# Altium project Quail_3.0.PrjPcb (part 2 of 3)

## Sheet LevelShifter.SchDoc: Misc
size Legal; Project: Olympus; Organization: Stanford SSI; Address1: L3, 12a Rodborough Rd; Address2: Frenchs Forest; Address3: NSW; Address4: Australia 2086; SheetNumber: n; SheetTotal: m
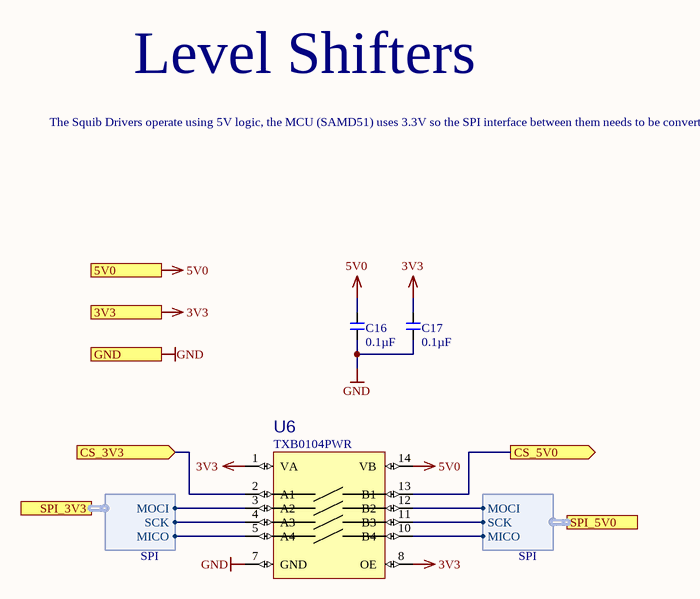
[diagram p3: LevelShifter.SchDoc]

### Parts
C16  Capacitance (shorthand): 0.1µF  [C0603]  (hidden comment: 490-1519-1-ND)
C17  Capacitance (shorthand): 0.1µF  [C0603]  (hidden comment: 490-1519-1-ND)
U6  Manufacturer Part Number: TXB0104PWR  [14TSSOP65]  (hidden comment: LVLSHFT_TXB0104PWR)

### Ports
3V3 (in), 5V0 (in), CS_3V3 (in), CS_5V0 (out), GND (in), SPI_3V3 (harness SPI), SPI_5V0 (harness SPI)

### Harnesses
SPI: MICO, MOCI, SCK

### Nets
3V3: C17.1 U6.1(VA) U6.8(OE) ; port 3V3  [project net IOVDD]
5V0: C16.1 U6.14(VB) ; port 5V0
GND: C16.2 C17.2 U6.7(GND) ; port GND  [project net DGND]
SQB_CS: U6.2(A1) ; port CS_3V3
SQB_MICO: U6.5(A4) ; port SPI_3V3.MICO
SQB_MOCI: U6.3(A2) ; port SPI_3V3.MOCI
SQB_SCK: U6.4(A3) ; port SPI_3V3.SCK
SQUIB_CS: U6.13(B1) ; port CS_5V0
Squib_MICO: U6.10(B4) ; port SPI_5V0.MICO
Squib_MOCI: U6.12(B2) ; port SPI_5V0.MOCI
Squib_SCK: U6.11(B3) ; port SPI_5V0.SCK

### Notes on the sheet
- Level Shifters
- The Squib Drivers operate using 5V logic, the MCU (SAMD51) uses 3.3V so the SPI interface between them needs to be converted
- PROJECT
- SHEET
- Powered By
- Sheet
- of
- REVISION
- ssi.stanford.edu
- ENGINEER
- REVIEWER
- REVIEWED ON

### Library data of the parts
C16 C17 = CMP-119-0065-1: as C7 on sheet BatteryRegulators; Rated Voltage: 50V; Dielectric: X7R
U6 = CMP-045-0016-1: 4 Pin Bidirectional levelshifter 5v-3.3v; Manufacturer: Texas Instruments; Translator Type: Voltage Level; Number of Circuits: 1; Channels per Circuit: 4; Voltage - VCCA: 1.2 V ~ 3.6 V; Voltage - VCCB: 1.65 V ~ 5.5 V; Output Type: Tri-State, Non-Inverted; Data Rate: 100Mbps; Value: *; RoHS: RoHS Compliant; Stock 1: 16134; Pricing 1: 1=1.39, 10=1.246, 100=0.9717, 500=0.8036, 1000=0.6355 (USD); Packaging: Cut Tape (CT); Channel Type: Bidirectional; Input Signal: -; Output Signal: -; Operating Temperature: -40°C ~ 85°C (TA); Features: Auto-Direction Sensing; Mounting Type: Surface Mount; Package / Case: 14-TSSOP (0.173", 4.40mm Width); Supplier Device Package: 14-TSSOP; ComponentLink1URL: http://www.ti.com/lit/ds/symlink/txb0104.pdf; ComponentLink1Description: http://www.ti.com/lit/ds/symlink/txb0104.pdf; Source: ic_interface.SchLib; Design Item ID: LVLSHFT_TXB0104PWR

## Sheet Blink_Blink_Beep_Boop.SchDoc: Blinks and Boops
size Legal; DocumentNumber: 8; SheetNumber: 8; SheetTotal: 8; Project: Olympus
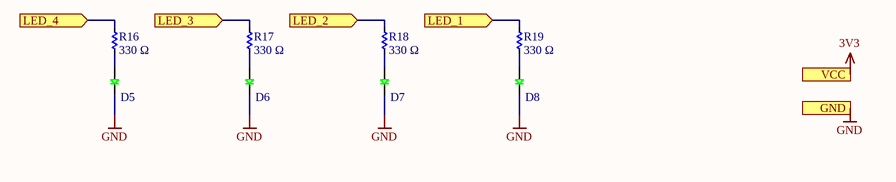
[diagram p4: Blink_Blink_Beep_Boop.SchDoc]

### Parts
D5  LED_C503B-GCS-CB0C0781  [LED_TH_5MM]  (value not drawn)
D6  LED_C503B-GCS-CB0C0781  [LED_TH_5MM]  (value not drawn)
D7  LED_C503B-GCS-CB0C0781  [LED_TH_5MM]  (value not drawn)
D8  LED_C503B-GCS-CB0C0781  [LED_TH_5MM]  (value not drawn)
R16  Resistance: 330 Ω  [R0603]  (hidden comment: 311-330HRCT-ND)
R17  Resistance: 330 Ω  [R0603]  (hidden comment: 311-330HRCT-ND)
R18  Resistance: 330 Ω  [R0603]  (hidden comment: 311-330HRCT-ND)
R19  Resistance: 330 Ω  [R0603]  (hidden comment: 311-330HRCT-ND)

### Ports
GND (in), LED_1 (in), LED_2 (in), LED_3 (in), LED_4 (in), VCC (in)

### Nets
GND: D5.2(K) D6.2(K) D7.2(K) D8.2(K) ; port GND  [project net DGND]
LED1: R19.2 ; port LED_1
LED2: R18.2 ; port LED_2
LED3: R17.2 ; port LED_3
LED4: R16.2 ; port LED_4
NetD5_1: D5.1(A) R16.1
NetD6_1: D6.1(A) R17.1
NetD7_1: D7.1(A) R18.1
NetD8_1: D8.1(A) R19.1

### Notes on the sheet
- PROJECT
- SHEET
- Powered By
- Sheet
- of
- REVISION
- ssi.stanford.edu
- ENGINEER
- REVIEWER
- REVIEWED ON

### Library data of the parts
D5-D8 = CMP-033-0070-3: LED GREEN CLEAR 5MM ROUND T/H; Manufacturer: Cree; Lens Colour: Colorless; Luminous Intensity: 24850mcd; Viewing Angle: 30°; Forward Current: 20mA; Forward Voltage: 3.2V; Lens Style: Dome; Dominant Wavelength: 527nm; Power Rating: 120mW; Reverse Voltage (DC): 5V; Number of LEDs: 1; Manufacturer Part Number: C503B-GCS-CB0C0781; Stock 1: 191; Pricing 1: 1=0.25, 10=0.236, 100=0.2184, 1000=0.1954, 50000=0.1814 (USD); Mount: Through Hole; Case/Package: Radial; Colour: Green; Min Operating Temperature: -40°C; Max Operating Temperature: 95°C; Illumination Colour: Green; Packaging: Bulk; Package Quantity: 500; Lens Transparency: Clear; Test Current: 20mA; Wavelength: 527nm; Length: 5.8mm; Height: 12.7mm; Width: 5mm; ComponentLink1URL: http://www.mouser.com/ds/2/90/cree.C503B%20BAS%20BAN%20BCS%20BCN%20GAS%20GAN%20GCS%20GCN%201094[1]-310350.pdf; ComponentLink1Description: http://www.mouser.com/ds/2/90/cree.C503B%20BAS%20BAN%20BCS%20BCN%20GAS%20GAN%20GCS%20GCN%201094[1]-310350.pdf; ComponentLink2URL: http://www.cree.com/led-components/media/documents/C503B-BAS-BAN-BCS-BCN-GAS-GAN-GCS-GCN-1094.pdf; ComponentLink2Description: http://www.cree.com/led-components/media/documents/C503B-BAS-BAN-BCS-BCN-GAS-GAN-GCS-GCN-1094.pdf; Design Item ID: LED_C503B-GCS-CB0C0781; Source: diode.SchLib
R16-R19 = CMP-126-0120-2: RES SMD 330 OHM 1% 1/10W 0603; Manufacturer Part Number: RC0603FR-07330RL; Manufacturer: Yageo; Resistance (Sortable): 330; Power (Watts): 0.1W, 1/10W; Temperature Coefficient: ±100ppm/°C; Datasheets: http://www.yageo.com/documents/recent/PYu-RC_Group_51_RoHS_L_9.pdf; Image: //media.digikey.com/Renders/Yageo%20Renders/0603-(1608-Metric).jpg; Tolerance: ±1%; Operating Temperature: -55°C ~ 155°C

## Sheet SAMD51.SchDoc
size A3
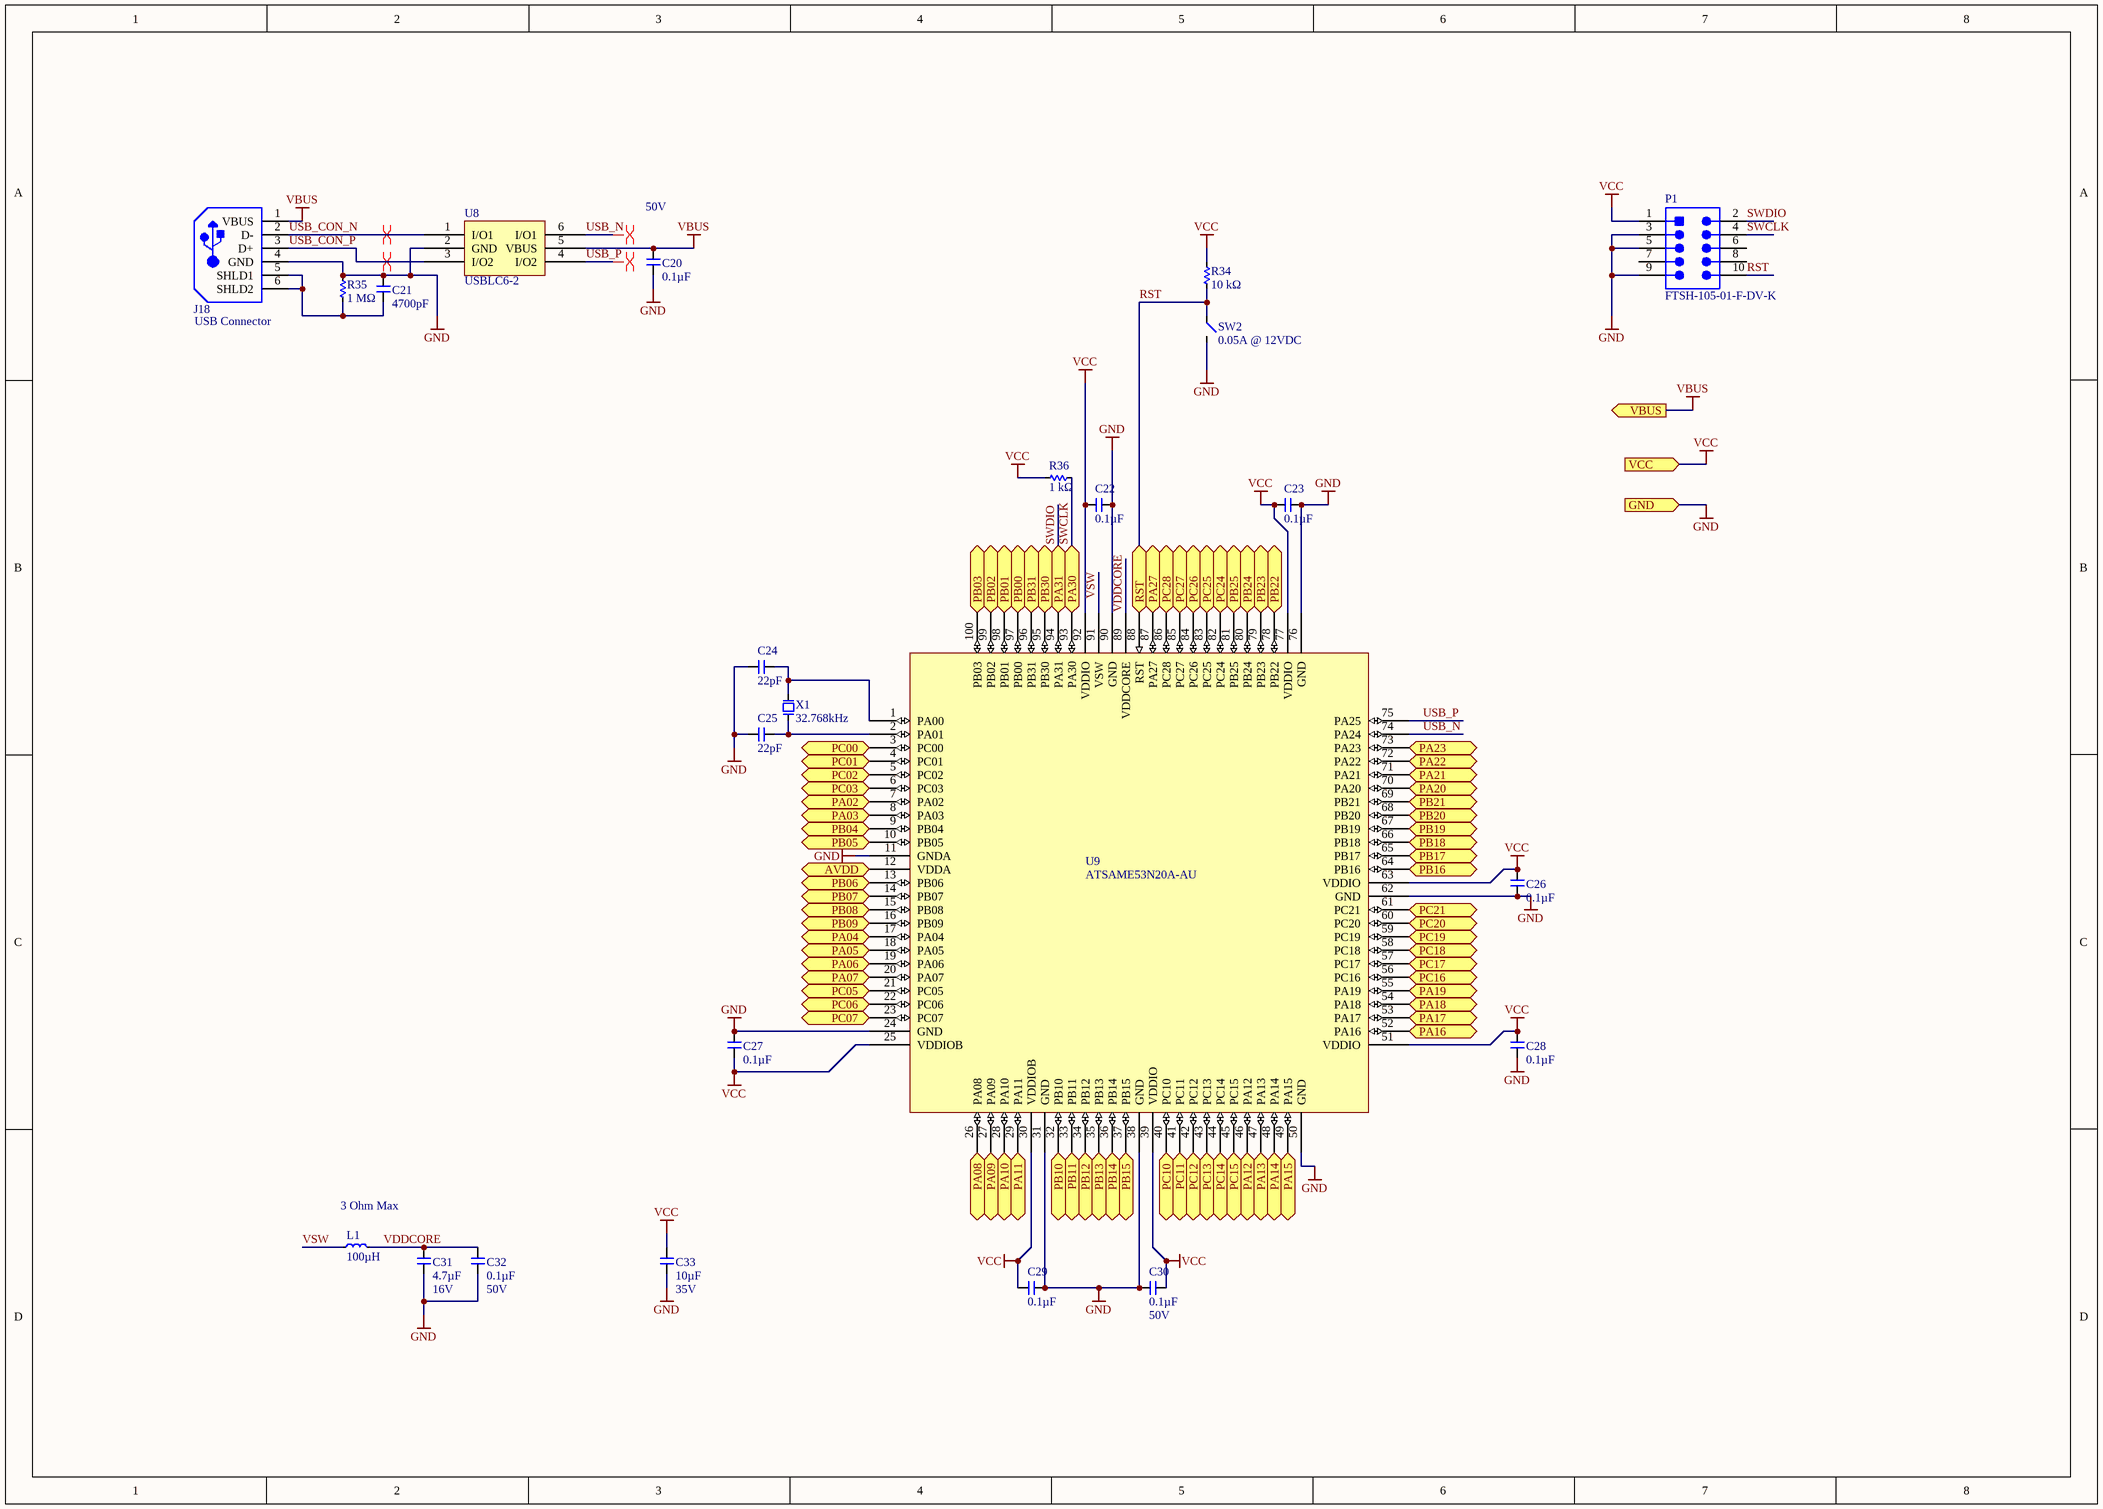
[diagram p5: SAMD51.SchDoc]

### Parts
C20  Capacitance (shorthand): 0.1µF  Rated Voltage: 50V  [C0603]  (hidden comment: 490-1519-1-ND)
C21  Capacitance (shorthand): 4700pF  [C0603]  (hidden comment: 490-1506-1-ND)
C22  Capacitance (shorthand): 0.1µF  [C0603]  (hidden comment: 490-1519-1-ND)
C23  Capacitance (shorthand): 0.1µF  [C0603]  (hidden comment: 490-1519-1-ND)
C24  Capacitance (shorthand): 22pF  [C0603]  (hidden comment: 490-1411-1-ND)
C25  Capacitance (shorthand): 22pF  [C0603]  (hidden comment: 490-1411-1-ND)
C26  Capacitance (shorthand): 0.1µF  [C0603]  (hidden comment: 490-1519-1-ND)
C27  Capacitance (shorthand): 0.1µF  [C0603]  (hidden comment: 490-1519-1-ND)
C28  Capacitance (shorthand): 0.1µF  [C0603]  (hidden comment: 490-1519-1-ND)
C29  Capacitance (shorthand): 0.1µF  [C0603]  (hidden comment: 490-1519-1-ND)
C30  Capacitance (shorthand): 0.1µF  Rated Voltage: 50V  [C0603]  (hidden comment: 490-1519-1-ND)
C31  Capacitance (shorthand): 4.7µF  Rated Voltage: 16V  [C0603]  (hidden comment: 311-1785-1-ND)
C32  Capacitance (shorthand): 0.1µF  Rated Voltage: 50V  [C0603]  (hidden comment: 490-1519-1-ND)
C33  Capacitance (shorthand): 10µF  Rated Voltage: 35V  [C0603]  (hidden comment: 490-13248-1-ND)
J18  USBR-B-S-S-O-TH  [SMTC-USBR-TH-4_V]  (value not drawn)
L1  DC Resistance (DCR): 3 Ohm Max  Inductance: 100µH  [C1210]  (hidden comment: IND_BRL3225T101K)
P1  FTSH-105-01-F-DV-K  [SMTC-FTSH-105-01-L-DV-K_V]
R34  Resistance: 10 kΩ  [R0603]  (hidden comment: 311-10.0KHRCT-ND)
R35  Resistance: 1 MΩ  [R0603]  (hidden comment: 311-1.00MHRCT-ND)
R36  Resistance: 1 kΩ  [R0603]  (hidden comment: 311-1.00KHRCT-ND)
SW2  Contact Rating @ Voltage: 0.05A @ 12VDC  [SWITCH_FSM4JSMATR]  (hidden comment: SWITCH_FSM4JSMATR)
U8  USBLC6-2  [6SOT23]
U9  ATSAME53N20A-AU  [TSQFP50P1600X1600X120-100N]
X1  Frequency: 32.768kHz  [XTAL_TXC_9HT10]  (hidden comment: XTAL_9HT10-32.768KEZF-T)

### Ports
AVDD (bidir), GND (in), PA02 (bidir), PA03 (bidir), PA04 (bidir), PA05 (bidir), PA06 (bidir), PA07 (bidir), PA08 (bidir), PA09 (bidir), PA10 (bidir), PA11 (bidir), PA12 (bidir), PA13 (bidir), PA14 (bidir), PA15 (bidir), PA16 (bidir), PA17 (bidir), PA18 (bidir), PA19 (bidir), PA20 (bidir), PA21 (bidir), PA22 (bidir), PA23 (bidir), PA27 (bidir), PA30 (bidir), PA31 (bidir), PB00 (bidir), PB01 (bidir), PB02 (bidir), PB03 (bidir), PB04 (bidir), PB05 (bidir), PB06 (bidir), PB07 (bidir), PB08 (bidir), PB09 (bidir), PB10 (bidir), PB11 (bidir), PB12 (bidir), PB13 (bidir), PB14 (bidir), PB15 (bidir), PB16 (bidir), PB17 (bidir), PB18 (bidir), PB19 (bidir), PB20 (bidir), PB21 (bidir), PB22 (bidir), PB23 (bidir), PB24 (bidir), PB25 (bidir), PB30 (bidir), PB31 (bidir), PC00 (bidir), PC01 (bidir), PC02 (bidir), PC03 (bidir), PC05 (bidir), PC06 (bidir), PC07 (bidir), PC10 (bidir), PC11 (bidir), PC12 (bidir), PC13 (bidir), PC14 (bidir), PC15 (bidir), PC16 (bidir), PC17 (bidir), PC18 (bidir), PC19 (bidir), PC20 (bidir), PC21 (bidir), PC24 (bidir), PC25 (bidir), PC26 (bidir), PC27 (bidir), PC28 (bidir), RST (bidir), VBUS (out), VCC (in)

### Nets
GND: C20.2 C21.1 C22.1 C23.1 C24.1 C25.1 C26.1 C27.1 C28.1 C29.2 C30.2 C31.1 C32.2 C33.1 J18.4(GND) P1.3 P1.5 P1.9 R35.2 SW2.2 U8.2(GND) U9.11(GNDA) U9.24(GND) U9.31(GND) U9.38(GND) U9.50(GND) U9.62(GND) U9.76(GND) U9.90(GND) ; port GND  [project net DGND]
VBUS: C20.1 J18.1(VBUS) U8.5(VBUS) ; port VBUS
VCC: C22.2 C23.2 C26.2 C27.2 C28.2 C29.1 C30.1 C33.2 P1.1 R34.1 R36.2 U9.12(VDDA) U9.25(VDDIOB) U9.30(VDDIOB) U9.39(VDDIO) U9.51(VDDIO) U9.63(VDDIO) U9.77(VDDIO) U9.92(VDDIO) ; port VCC, port AVDD  [project net IOVDD]
ADC_CS: U9.69(PB21) ; port PB21
ADC_MICO: U9.79(PB23) ; port PB23
ADC_MOCI: U9.85(PC27) ; port PC27
ADC_SCK: U9.86(PC28) ; port PC28
ADC_SYNC: U9.87(PA27) ; port PA27
BatterySense: U9.15(PB08) ; port PB08
BUSY: U9.83(PC25) ; port PC25
CAN_STBY_1: U9.68(PB20) ; port PB20
CurrentSense: U9.16(PB09) ; port PB09
DIO1: U9.82(PC24) ; port PC24
ETH_CRS_DV: U9.60(PC20) ; port PC20
ETH_INT: U9.96(PB31) ; port PB31
ETH_MDC: U9.36(PB14) ; port PB14
ETH_MDIO: U9.37(PB15) ; port PB15
ETH_REF_CLK: U9.48(PA14) ; port PA14
ETH_RXD0: U9.47(PA13) ; port PA13
ETH_RXD1: U9.46(PA12) ; port PA12
ETH_RXER: U9.49(PA15) ; port PA15
ETH_TXD0: U9.54(PA18) ; port PA18
ETH_TXD1: U9.55(PA19) ; port PA19
ETH_TXEN: U9.53(PA17) ; port PA17
GPS_PPS: U9.78(PB22) ; port PB22
GPS_RX: U9.80(PB24) ; port PB24
GPS_TX: U9.81(PB25) ; port PB25
LED1: U9.64(PB16) ; port PB16
LED2: U9.65(PB17) ; port PB17
LED3: U9.66(PB18) ; port PB18
LED4: U9.67(PB19) ; port PB19
NRESET: U9.84(PC26) ; port PC26
PWR_FLT: U9.6(PC03) ; port PC03
RST: P1.10 R34.2 SW2.1 U9.88(RST) ; port RST
SD_CLK: U9.33(PB11) ; port PB11
SD_CMD: U9.26(PA08) ; port PA08
SD_DAT0: U9.27(PA09) ; port PA09
SD_DAT1: U9.28(PA10) ; port PA10
SD_DAT2: U9.29(PA11) ; port PA11
SD_DAT3: U9.32(PB10) ; port PB10
SOL_CTRL: U9.13(PB06) ; port PB06
SOL_CTRL: U9.14(PB07) ; port PB07  [a separate net that carries the same name]
SOL_CTRL: U9.17(PA04) ; port PA04  [a separate net that carries the same name]
SOL_CTRL: U9.18(PA05) ; port PA05  [a separate net that carries the same name]
SOL_CTRL: U9.19(PA06) ; port PA06  [a separate net that carries the same name]
SOL_CTRL: U9.20(PA07) ; port PA07  [a separate net that carries the same name]
SOL_CTRL: U9.40(PC10) ; port PC10  [a separate net that carries the same name]
SOL_CTRL: U9.41(PC11) ; port PC11  [a separate net that carries the same name]
SOL_CTRL: U9.42(PC12) ; port PC12  [a separate net that carries the same name]
SOL_CTRL: U9.43(PC13) ; port PC13  [a separate net that carries the same name]
SOL_CTRL: U9.44(PC14) ; port PC14  [a separate net that carries the same name]
SOL_CTRL: U9.45(PC15) ; port PC15  [a separate net that carries the same name]
SQB_CS: U9.58(PC18) ; port PC18
SQB_MICO: U9.59(PC19) ; port PC19
SQB_MOCI: U9.57(PC17) ; port PC17
SQB_SCK: U9.56(PC16) ; port PC16
SWCLK: P1.4 R36.1 U9.93(PA30) ; port PA30
SWDIO: P1.2 U9.94(PA31) ; port PA31
USB_CON_N: J18.2(D-) U8.1(I/O1)
USB_CON_P: J18.3(D+) U8.3(I/O2)
USB_N: U8.6(I/O1) U9.74(PA24)
USB_P: U8.4(I/O2) U9.75(PA25)
VDDCORE: C31.2 C32.1 L1.1 U9.89(VDDCORE)
VSW: L1.2 U9.91(VSW)
NetC21_2: C21.2 J18.5(SHLD1) J18.6(SHLD2) R35.1
NetC24_2: C24.2 U9.1(PA00) X1.2
NetC25_2: C25.2 U9.2(PA01) X1.1
NetCANA1_1: U9.35(PB13) ; port PB13
NetCANA1_4: U9.34(PB12) ; port PB12
NetTP1_1: U9.23(PC07) ; port PC07
NetTP2_1: U9.22(PC06) ; port PC06
NetTP3_1: U9.21(PC05) ; port PC05
NetTP30_1: U9.10(PB05) ; port PB05
NetTP31_1: U9.95(PB30) ; port PB30
NetTP32_1: U9.52(PA16) ; port PA16
NetTP33_1: U9.61(PC21) ; port PC21
NetTP34_1: U9.9(PB04) ; port PB04
NetTP35_1: U9.97(PB00) ; port PB00
NetTP36_1: U9.98(PB01) ; port PB01
NetTP37_1: U9.99(PB02) ; port PB02
NetTP38_1: U9.100(PB03) ; port PB03
NetTP39_1: U9.8(PA03) ; port PA03
NetTP40_1: U9.7(PA02) ; port PA02
NetTP41_1: U9.3(PC00) ; port PC00
NetTP42_1: U9.4(PC01) ; port PC01
NetTP43_1: U9.5(PC02) ; port PC02
NetU9_70: U9.70(PA20) ; port PA20
NetU9_71: U9.71(PA21) ; port PA21
NetU9_72: U9.72(PA22) ; port PA22
NetU9_73: U9.73(PA23) ; port PA23

Not connected (* = marked no-connect by the designer): P1 6 7 8

### Layout directives
differential pair: USB_CON_N, USB_CON_P, USB_N, USB_P

### Notes on the sheet
- (near J18) USB Connector
- Title
- Size:
- Date:
- A4
- Number:
- Time:
- Revision:
- Sheet
- of
- File:

### Library data of the parts
C20 C22 C23 C26-C30 C32 = CMP-119-0065-1: as C7 on sheet BatteryRegulators; Dielectric: X7R
  C22 C23 C26-C29: Rated Voltage: 50V
C21 = CMP-119-0049-1: CAP CER 0603 4700pF X7R 50V 10%; Manufacturer: Murata Electronics North America; Capacitance - pF (Machine readable): #NAME?; Dielectric: X7R; Rated Voltage: 50V
C24 C25 = CMP-119-0008-1: CAP CER 22PF 50V C0G/NP0 0603; Manufacturer: Murata Electronics North America; Capacitance - pF (Machine readable): 22; Dielectric: C0G, NP0; Rated Voltage: 50V
C31 = CMP-119-0070-1: CAP CER 4.7UF 16V X5R 0603 10%; Manufacturer: Yageo; Capacitance - pF (Machine readable): #NAME?; Dielectric: X5R
C33 = CMP-119-0071-1: as C8 on sheet BatteryRegulators; Dielectric: X5R
J18 = CMP-00011-3: Conn USB F 4 POS 2.5mm Solder RA Thru-Hole 4 Terminal 1 Port Tray; Max Voltage Rating (AC): 30V; USB Standard: USB 2.0; Number of Contacts: 4; Gender: Receptacle; Number of Ports: 1; Contact Plating: Gold; REACH SVHC: No SVHC; Radiation Hardening: No; Mount: Through Hole,Horizontal; Packaging: Tray; Length: 14.9mm; Max Operating Temperature: 85°C; Termination: Solder; Depth: 16.5mm; Connector Type: USB; Contact Material: Bronze; Pitch: 2.5mm; Series: -; Number of Terminals/Pins: 4; Orientation: Right Angle; Package Quantity: 1; Min Operating Temperature: -50°C; Housing Material: Thermoplastic
L1 = CMP-052-0010-1: INDUCTOR 100UH 270MA 1210 SMD; Manufacturer: Taiyo Yuden; Current - Temperature Rise: 250mA; Tolerance: ±10%; Shielding: Unshielded; Frequency - Self Resonant: 5MHz; Frequency - Test: 100kHz; Manufacturer Part Number: BRL3225T101K; RoHS: RoHS Compliant; Current - Saturation: 270mA; Q @ Freq: -; Applications: Power Supplies; Material - Core: -; Package / Case: 1210 (3225 Metric); Mounting Type: Surface Mount; Packaging: Cut Tape (CT); Operating Temperature: -40°C ~ 105°C; ComponentLink1URL: http://www.yuden.co.jp/ut/product/pdf/wound07_e.pdf; ComponentLink1Description: Datasheet; Current: 270mA; Stock 1: 84687; Source: inductor.SchLib; Pricing 1: 1=0.16, 10=0.155, 50=0.145, 100=0.1354, 500=0.10638, 1000=0.08704 (GBP); Design Item ID: IND_BRL3225T101K
P1 = CMP-2000-05352-1: Male Header, Pitch 1.27 mm, 2 x 5 Position, Height 6.12 mm, RoHS, Tube; Manufacturer: Samtec; Number of Positions: 10; Connector Type: Header,Shrouded; Number of Positions Loaded: All; Row Spacing: 0.050"(1.27mm); Fastening Type: -; Package Reference: FTSH-105-01-L-DV-K; Termination: Solder; Package URL: http://suddendocs.samtec.com/prints/ftsh-1xx-xx-xxx-dv-xxx-footprint.pdf; Number of Rows: 2; Contact Finish Thickness: 3µin(0.08µm); Contact Type: MalePin; Manufacturer URL: http://www.samtec.com/; Series: FTSH; Features: -; Contact Finish: Gold; Color: Black; Family: RectangularConnectors-Headers,MalePins; Datasheet URL: http://suddendocs.samtec.com/prints/ftsh-1xx-xx-xxx-dv-xxx-mkt.pdf; Package Description: Male Header, Pitch 1.27 mm, 2 x 5 Position, Height 5.97 mm, Tail Length 4.32 mm; Mounting Type: SurfaceMount; Datasheet Version: Rev. ET, 10/1995; Category: Connectors,Interconnects; Packaging: Tube; Contact Mating Length: 0.120"(3.05mm); Pitch: 0.050"(1.27mm)
R34 = CMP-126-0273-2: RES SMD 10K OHM 1% 1/10W 0603; Manufacturer Part Number: RC0603FR-0710KL; Manufacturer: Yageo; Resistance (Sortable): 10000; Power (Watts): 0.1W, 1/10W; Temperature Coefficient: ±100ppm/°C; Datasheets: http://www.yageo.com/documents/recent/PYu-RC_Group_51_RoHS_L_9.pdf; Image: //media.digikey.com/Renders/Yageo%20Renders/0603-(1608-Metric).jpg; Tolerance: ±1%; Operating Temperature: -55°C ~ 155°C
R35 = CMP-126-0484-2: RES SMD 1M OHM 1% 1/10W 0603; Manufacturer Part Number: RC0603FR-071ML; Manufacturer: Yageo; Resistance (Sortable): 1000000; Power (Watts): 0.1W, 1/10W; Temperature Coefficient: ±100ppm/°C; Datasheets: http://www.yageo.com/documents/recent/PYu-RC_Group_51_RoHS_L_9.pdf; Image: //media.digikey.com/Renders/Yageo%20Renders/0603-(1608-Metric).jpg; Tolerance: ±1%; Operating Temperature: -55°C ~ 155°C
R36 = CMP-126-0172-2: RES SMD 1K OHM 1% 1/10W 0603; Manufacturer Part Number: RC0603FR-071KL; Manufacturer: Yageo; Resistance (Sortable): 1000; Power (Watts): 0.1W, 1/10W; Temperature Coefficient: ±100ppm/°C; Datasheets: http://www.yageo.com/documents/recent/PYu-RC_Group_51_RoHS_L_9.pdf; Image: //media.digikey.com/Renders/Yageo%20Renders/0603-(1608-Metric).jpg; Tolerance: ±1%; Operating Temperature: -55°C ~ 155°C
SW2 = CMP-062-0009-1: SWITCH TACTILE SPST-NO 0.05A 12V; Manufacturer: TE Connectivity; Switch Function: Off-Mom; Actuator Type: Standard; Actuator Height off PCB, from Pins: 5.00mm; Actuator Orientation: Top Actuated; Outline: 6.00mm x 6.00mm; Illumination: Non-Illuminated; Operating Force: 160gf; Actuator Material: Polyphenylene Sulfide (PPS); Switch Travel: 0.25mm; Mechanical Life: 100,000 Cycles; Manufacturer Part Number: FSM4JSMATR; RoHS: RoHS Compliant; Stock 1: 24144; Pricing 1: 1=0.36, 10=0.34, 25=0.2912, 50=0.2474, 100=0.2377, 250=0.21344, 500=0.20374 (USD); Circuit: SPST-NO; Mounting Type: Surface Mount; Termination Style: Gull Wing; Illumination Voltage (Nominal): -; Illumination Type, Color: -; Ingress Protection: -; Features: -; Packaging: Cut Tape (CT); Operating Temperature: -35°C ~ 85°C; ComponentLink1URL: http://www.te.com/commerce/DocumentDelivery/DDEController?Action=srchrtrv&DocNm=2-1437565-7&DocType=Customer+Drawing&DocLang=English; ComponentLink1Description: Datasheet; Source: miscellaneous.SchLib; Design Item ID: SWITCH_FSM4JSMATR
U8 = CMP-038-0001-1: Manufacturer: STMicroelectronics; Manufacturer Part Number: USBLC6-2SC6; Unidirectional Channels: 2; Voltage - Reverse Standoff (Typ): 5.25V; Voltage - Breakdown (Min): 6V; Voltage - Clamping (Max) @ Ipp: 17V; Current - Peak Pulse (10/1000µs): 5A (8/20µs); Power Line Protection: Yes; RoHS: RoHS Compliant; Stock 1: 31719; Pricing 1: 1=0.51, 10=0.411, 100=0.2802, 500=0.21012, 1000=0.15759 (USD); Packaging: Cut Tape (CT); Part Status: Active; Bidirectional Channels: -; Power - Peak Pulse: -; Applications: Ethernet; Capacitance @ Frequency: -; Operating Temperature: -40°C ~ 125°C (TJ); Mounting Type: Surface Mount; Package / Case: SOT-23-6; Supplier Device Package: SOT-23-6; ComponentLink1URL: http://www.st.com/web/en/resource/technical/document/datasheet/CD00050750.pdf; ComponentLink1Description: http://www.st.com/web/en/resource/technical/document/datasheet/CD00050750.pdf; Design Item ID: USBLC6-2; Source: ic_analog.SchLib
U9 = CMP-025-0003-5: MCU 32-bit ARM Cortex M4F RISC 1MB Flash 3.3V 100-Pin TQFP Tray
X1 = CMP-066-0008-1: CRYSTAL 32.768 KHZ 12.5 PF SMD; Manufacturer: TXC CORPORATION; Frequency Tolerance: ±10ppm; ESR (Equivalent Series Resistance): 70 kOhm; Operating Mode: Fundamental; Load Capacitance: 12.5pF; Manufacturer Part Number: 9HT10-32.768KEZF-T; RoHS: RoHS Compliant; Stock 1: 5250; Pricing 1: 1=1.88, 10=1.625, 50=1.425, 100=1.125, 500=0.95, 1000=0.75 (USD); Frequency Stability: -; Operating Temperature: -40°C ~ 85°C; Ratings: -; Mounting Type: Surface Mount; Package / Case: 2-SMD; Size / Dimension: 0.126" L x 0.059" W (3.20mm x 1.50mm); Height: 0.033" (0.85mm); Packaging: Cut Tape (CT); ComponentLink1URL: http://www.txccrystal.com/images/pdf/9ht10.pdf; ComponentLink1Description: Datasheet; Design Item ID: XTAL_9HT10-32.768KEZF-T; Source: oscillator.SchLib

## Sheet SD.SchDoc
size A4
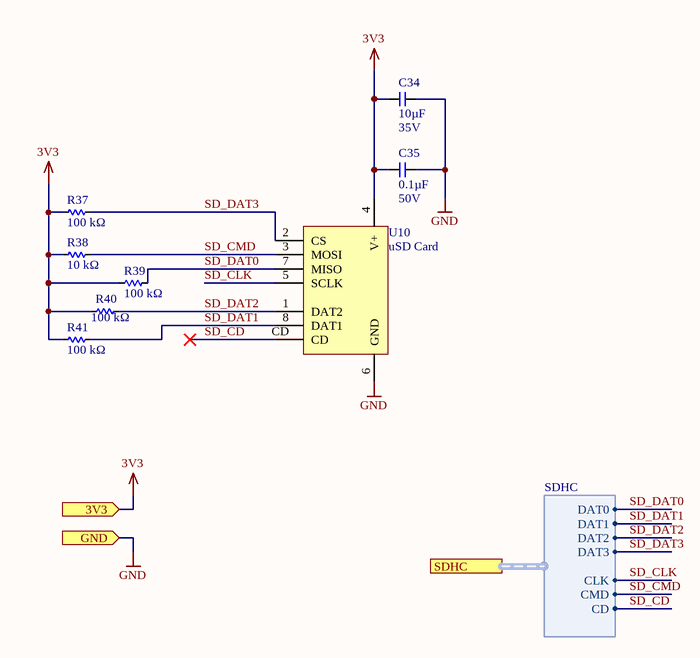
[diagram p6: SD.SchDoc]

### Parts
C34  Capacitance (shorthand): 10µF  Rated Voltage: 35V  [C0603]  (hidden comment: 490-13248-1-ND)
C35  Capacitance (shorthand): 0.1µF  Rated Voltage: 50V  [C0603]  (hidden comment: 490-1519-1-ND)
R37  Resistance: 100 kΩ  [R0603]  (hidden comment: 311-100KHRCT-ND)
R38  Resistance: 10 kΩ  [R0603]  (hidden comment: 311-10.0KHRCT-ND)
R39  Resistance: 100 kΩ  [R0603]  (hidden comment: 311-100KHRCT-ND)
R40  Resistance: 100 kΩ  [R0603]  (hidden comment: 311-100KHRCT-ND)
R41  Resistance: 100 kΩ  [R0603]  (hidden comment: 311-100KHRCT-ND)
U10  uSD Card  [MICROSD_CARD_SOCKET]

### Ports
3V3 (in), GND (in), SDHC (harness SDHC)

### Harnesses
SDHC: DAT3, DAT0, DAT2, DAT1, CLK, CMD, CD

### Nets
3V3: C34.2 C35.1 R37.1 R38.1 R39.1 R40.1 R41.1 U10.4(V+) ; port 3V3  [project net IOVDD]
GND: C34.1 C35.2 U10.6(GND) ; port GND  [project net DGND]
SD_CD: U10.CD ; port SDHC.CD
SD_CLK: U10.5(SCLK) ; port SDHC.CLK
SD_CMD: R38.2 U10.3(MOSI) ; port SDHC.CMD
SD_DAT0: R39.2 U10.7(MISO) ; port SDHC.DAT0
SD_DAT1: R41.2 U10.8(DAT1) ; port SDHC.DAT1
SD_DAT2: R40.2 U10.1(DAT2) ; port SDHC.DAT2
SD_DAT3: R37.2 U10.2(CS) ; port SDHC.DAT3

### Notes on the sheet
- Title
- Size:
- Date:
- A4
- Number:
- Time:
- Revision:
- Sheet
- of
- File:

### Library data of the parts
C34 = CMP-119-0071-1: as C8 on sheet BatteryRegulators; Dielectric: X5R
C35 = CMP-119-0065-1: as C7 on sheet BatteryRegulators; Dielectric: X7R
R37 R39-R41 = CMP-126-0382-2: RES SMD 100K OHM 1% 1/10W 0603; Manufacturer Part Number: RC0603FR-07100KL; Manufacturer: Yageo; Resistance (Sortable): 100000; Power (Watts): 0.1W, 1/10W; Temperature Coefficient: ±100ppm/°C; Datasheets: http://www.yageo.com/documents/recent/PYu-RC_Group_51_RoHS_L_9.pdf; Image: //media.digikey.com/Renders/Yageo%20Renders/0603-(1608-Metric).jpg; Tolerance: ±1%; Operating Temperature: -55°C ~ 155°C
R38 = CMP-126-0273-2: as R34 on sheet SAMD51; Datasheets: http://www.yageo.com/documents/recent/PYu-RC_Group_51_RoHS_L_9.pdf; Image: //media.digikey.com/Renders/Yageo%20Renders/0603-(1608-Metric).jpg; Tolerance: ±1%; Operating Temperature: -55°C ~ 155°C
U10 = CMP-030-0037-1: MICROSD CARD HOLDER, PUSH-PUSH; Manufacturer: 3M; Manufacturer Part Number: 2908-05WB-MG; Card Type: Secure Digital - microSD™; Number of Positions: 10 (8 + 2); Connector Type: Connector and Ejector; Insertion, Removal Method: Push In, Push Out; RoHS: RoHS Compliant; Stock 1: 32313; Pricing 1: 1=3.6, 10=3.458, 25=3.1704, 50=3.0262, 100=2.882, 250=2.52176, 500=2.4497, 1000=2.08945 (USD); Packaging: Cut Tape (CT); Ejector Side: -; Mounting Type: Surface Mount, Right Angle; Features: Switch; Height Above Board: 0.073" (1.85mm); Mounting Feature: Normal, Standard - Top; Contact Finish: Gold; Contact Finish Thickness: 15µin (0.38µm); ComponentLink1URL: http://multimedia.3m.com/mws/media/416257O/3mtm-card-connector-microsdtm-2900-series-ts2197.pdf; ComponentLink1Description: http://multimedia.3m.com/mws/media/416257O/3mtm-card-connector-microsdtm-2900-series-ts2197.pdf; Source: connector.SchLib; Design Item ID: MICRO_SD_CARD_HOLDER

## Sheet Radio.SchDoc
size Legal
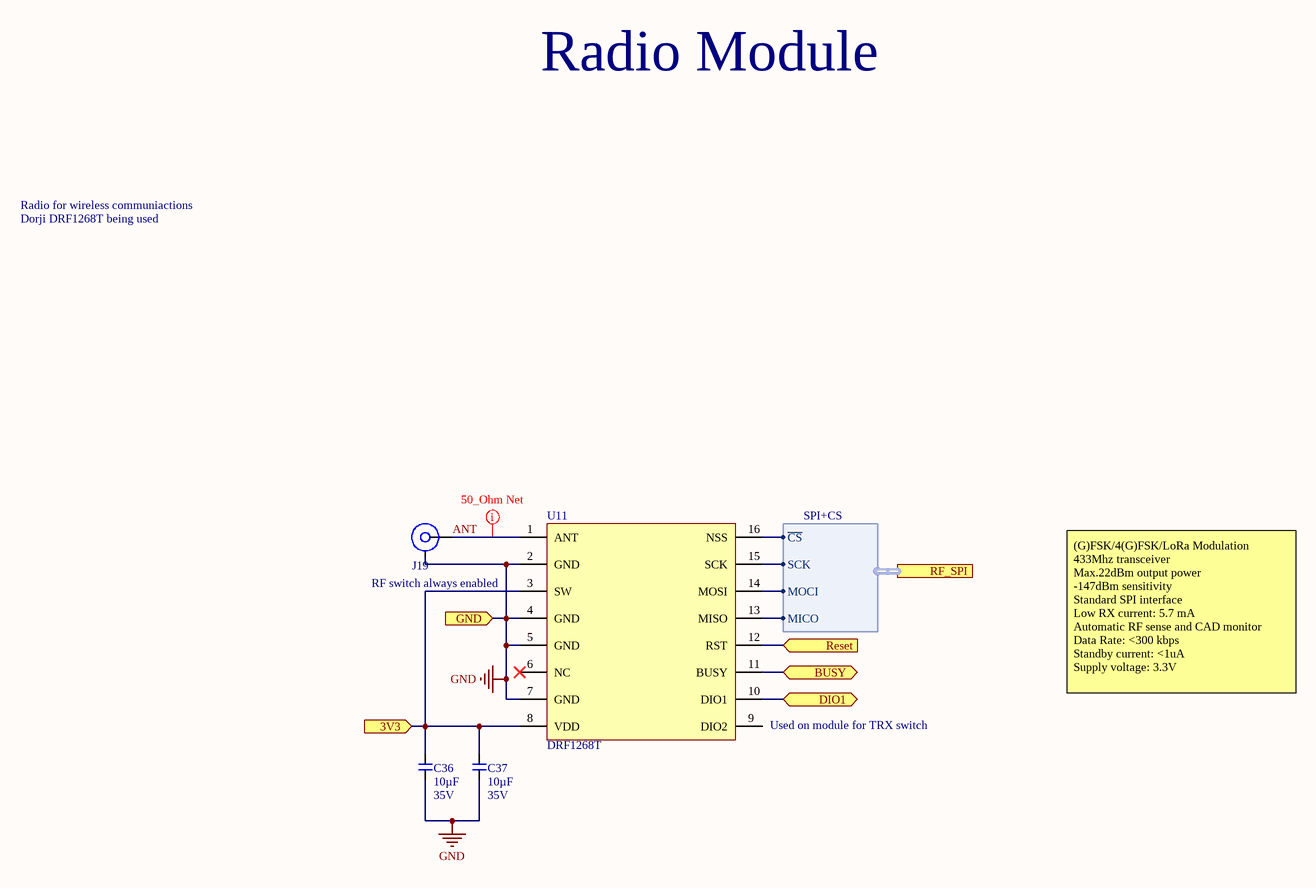
[diagram p7: Radio.SchDoc]

### Parts
C36  Capacitance (shorthand): 10µF  Rated Voltage: 35V  [C0603]  (hidden comment: 490-13248-1-ND)
C37  Capacitance (shorthand): 10µF  Rated Voltage: 35V  [C0603]  (hidden comment: 490-13248-1-ND)
J19  SMA_SAMTEC_TH_RA  [SMA_SAMTEC_SMA-J-P-X-RA-TH1]  (value not drawn)
U11  DRF1268T  [DRF1268T]

### Ports
3V3 (in), BUSY (bidir), DIO1 (bidir), GND (in), Reset (in), RF_SPI (harness SPI+CS)

### Harnesses
SPI+CS: SCK, MOCI, MICO, ~{CS}

### Nets
GND: C36.2 C37.2 J19.GND U11.2(GND) U11.4(GND) U11.5(GND) U11.7(GND) ; port GND  [project net DGND]
IOVDD: C36.1 C37.1 U11.3(SW) U11.8(VDD) ; port 3V3
ANT: J19.SIG U11.1(ANT)
BUSY: U11.11(BUSY) ; port BUSY
DIO1: U11.10(DIO1) ; port DIO1
NRESET: U11.12(RST) ; port Reset
NetU9_70: U11.13(MISO) ; port RF_SPI.MICO
NetU9_71: U11.16(NSS) ; port RF_SPI.~{CS}
NetU9_72: U11.15(SCK) ; port RF_SPI.SCK
NetU9_73: U11.14(MOSI) ; port RF_SPI.MOCI

Not connected (* = marked no-connect by the designer): U11 6(NC)* 9(DIO2)

### Layout directives
rule Clearance Constraint [Generic clearance = 0mil, and 21 value(s) for objects]: ANT

### Notes on the sheet
- Radio Module
- Radio for wireless communiactions
- Dorji DRF1268T being used
- RF switch always enabled
- (near U11) Used on module for TRX switch
- (G)FSK/4(G)FSK/LoRa Modulation
  433Mhz transceiver
  Max.22dBm output power
  -147dBm sensitivity
  Standard SPI interface
  Low RX current: 5.7 mA
  Automatic RF sense and CAD monitor
  Data Rate: <300 kbps
  Standby current: <1uA
  Supply voltage: 3.3V
- PROJECT
- SHEET
- Powered By
- Sheet
- of
- REVISION
- ssi.stanford.edu
- ENGINEER
- REVIEWER
- REVIEWED ON

### Library data of the parts
C36 C37 = CMP-119-0071-1: as C8 on sheet BatteryRegulators; Dielectric: X5R
J19 = CMP-030-0020-1: Source: connector.SchLib; Design Item ID: SMA_SAMTEC_TH_RA
U11 = CMP-025-0002-1: Dorji DRF1268T LoRa Module with SX1262 IC and TCXO; Design Item ID: RFM_Module

## Sheet AnalogFE.SchDoc: Analog Front-End
size A2; DrawnBy: Tim Vrakas; Engineer: Tim Vrakas
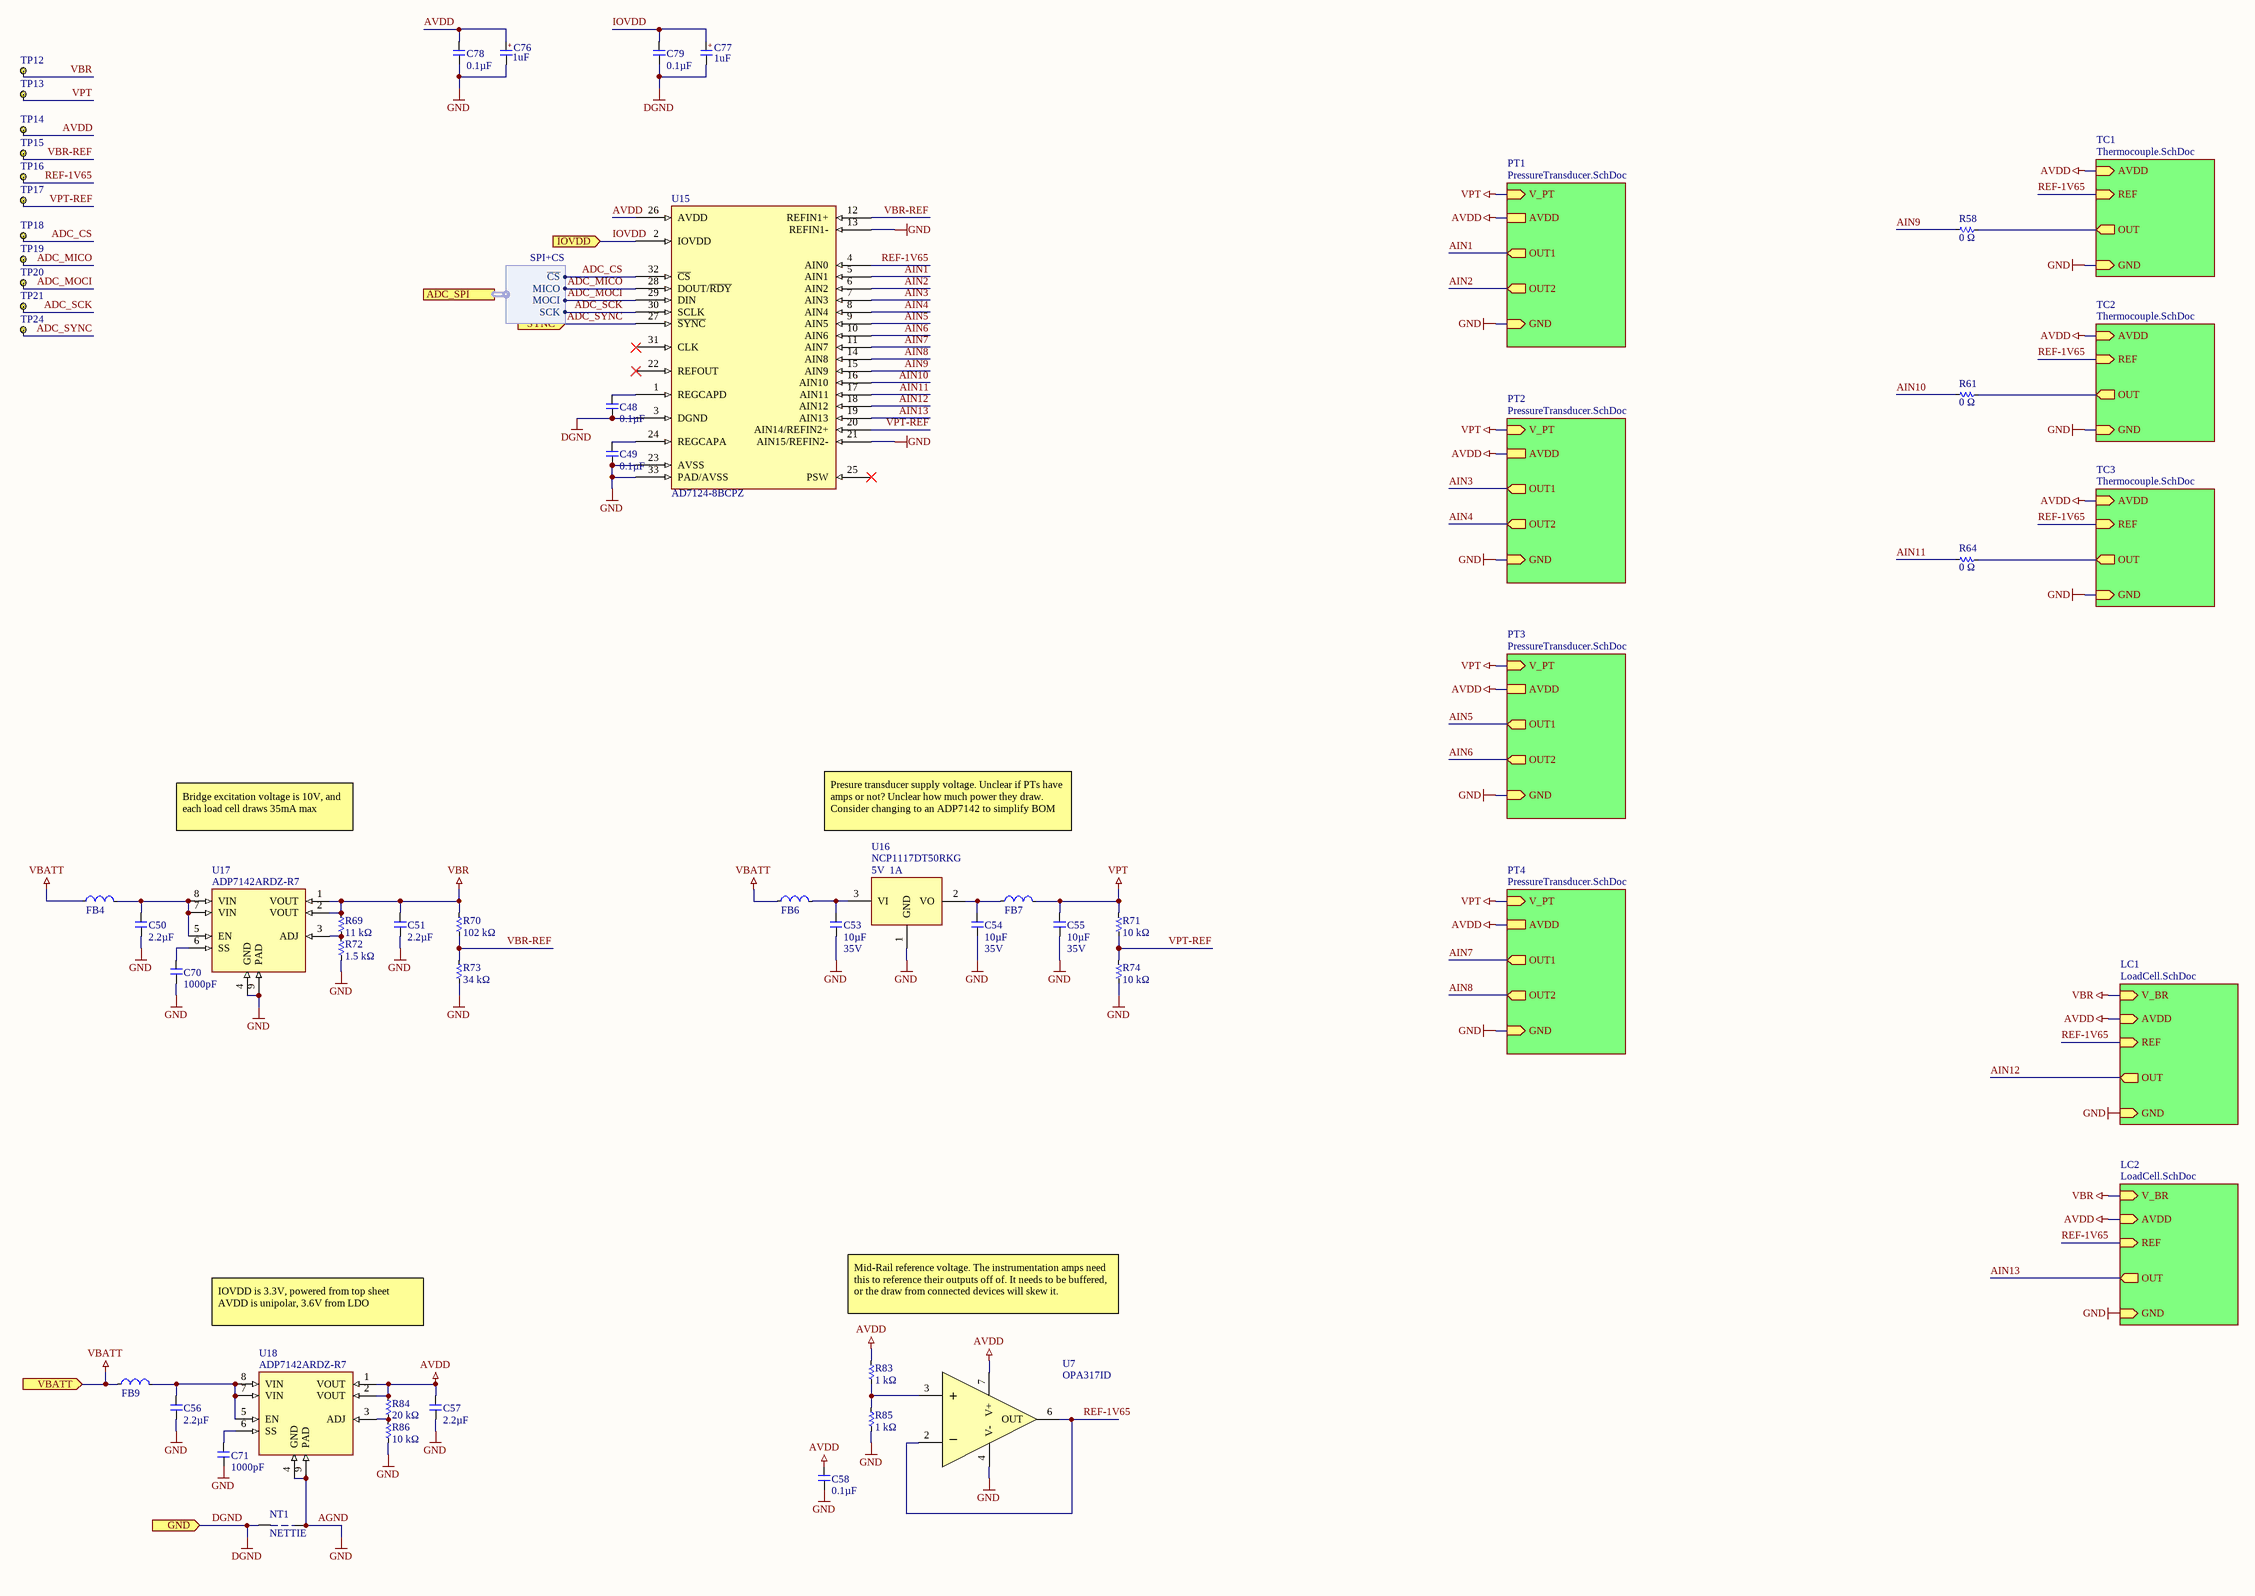
[diagram p8: AnalogFE.SchDoc]

### Parts
C48  Capacitance (shorthand): 0.1µF  [C0603]  (hidden comment: 490-1519-1-ND)
C49  Capacitance (shorthand): 0.1µF  [C0603]  (hidden comment: 490-1519-1-ND)
C50  Capacitance (shorthand): 2.2µF  [C0603]  (hidden comment: 490-10731-1-ND)
C51  Capacitance (shorthand): 2.2µF  [C0603]  (hidden comment: 490-10731-1-ND)
C53  Capacitance (shorthand): 10µF  Rated Voltage: 35V  [C0603]  (hidden comment: 490-13248-1-ND)
C54  Capacitance (shorthand): 10µF  Rated Voltage: 35V  [C0603]  (hidden comment: 490-13248-1-ND)
C55  Capacitance (shorthand): 10µF  Rated Voltage: 35V  [C0603]  (hidden comment: 490-13248-1-ND)
C56  Capacitance (shorthand): 2.2µF  [C0603]  (hidden comment: 490-10731-1-ND)
C57  Capacitance (shorthand): 2.2µF  [C0603]  (hidden comment: 490-10731-1-ND)
C58  Capacitance (shorthand): 0.1µF  [C0603]  (hidden comment: 490-1519-1-ND)
C70  Capacitance (shorthand): 1000pF  [C0603]  (hidden comment: 490-1494-1-ND)
C71  Capacitance (shorthand): 1000pF  [C0603]  (hidden comment: 490-1494-1-ND)
C76  Capacitance: 1uF  [C0603P]  (hidden comment: TACL105K010XTA)
C77  Capacitance: 1uF  [C0603P]  (hidden comment: TACL105K010XTA)
C78  Capacitance (shorthand): 0.1µF  [C0603]  (hidden comment: 490-1519-1-ND)
C79  Capacitance (shorthand): 0.1µF  [C0603]  (hidden comment: 490-1519-1-ND)
FB4  FB_120@100MHz_0603  [C0603]  (value not drawn)
FB6  FB_120@100MHz_0603  [C0603]  (value not drawn)
FB7  FB_120@100MHz_0603  [C0603]  (value not drawn)
FB9  FB_120@100MHz_0603  [C0603]  (value not drawn)
NT1  NETTIE  [NETTIE_10MIL]  (net tie, no BOM)
R58  Resistance: 0 Ω  [R0603]  (hidden comment: 311-0.0HRCT-ND)
R61  Resistance: 0 Ω  [R0603]  (hidden comment: 311-0.0HRCT-ND)
R64  Resistance: 0 Ω  [R0603]  (hidden comment: 311-0.0HRCT-ND)
R69  Resistance: 11 kΩ  [R0603]  (hidden comment: 311-11.0KHRCT-ND)
R70  Resistance: 102 kΩ  [R0603]  (hidden comment: 311-102KHRCT-ND)
R71  Resistance: 10 kΩ  [R0603]  (hidden comment: 311-10.0KHRCT-ND)
R72  Resistance: 1.5 kΩ  [R0603]  (hidden comment: 311-1.50KHRCT-ND)
R73  Resistance: 34 kΩ  [R0603]  (hidden comment: 311-34.0KHRCT-ND)
R74  Resistance: 10 kΩ  [R0603]  (hidden comment: 311-10.0KHRCT-ND)
R83  Resistance: 1 kΩ  [R0603]  (hidden comment: 311-1.00KHRCT-ND)
R84  Resistance: 20 kΩ  [R0603]  (hidden comment: 311-20.0KHRCT-ND)
R85  Resistance: 1 kΩ  [R0603]  (hidden comment: 311-1.00KHRCT-ND)
R86  Resistance: 10 kΩ  [R0603]  (hidden comment: 311-10.0KHRCT-ND)
TP12  TEST_POINT_BLACK_KEYSTONE_5001  [TEST_POINT_BLACK_KEYSTONE_5001-Footprint-1]  (value not drawn)
TP13  TEST_POINT_BLACK_KEYSTONE_5001  [TEST_POINT_BLACK_KEYSTONE_5001-Footprint-1]  (value not drawn)
TP14  TEST_POINT_BLACK_KEYSTONE_5001  [TEST_POINT_BLACK_KEYSTONE_5001-Footprint-1]  (value not drawn)
TP15  TEST_POINT_BLACK_KEYSTONE_5001  [TEST_POINT_BLACK_KEYSTONE_5001-Footprint-1]  (value not drawn)
TP16  TEST_POINT_BLACK_KEYSTONE_5001  [TEST_POINT_BLACK_KEYSTONE_5001-Footprint-1]  (value not drawn)
TP17  TEST_POINT_BLACK_KEYSTONE_5001  [TEST_POINT_BLACK_KEYSTONE_5001-Footprint-1]  (value not drawn)
TP18  TEST_POINT_BLACK_KEYSTONE_5001  [TEST_POINT_BLACK_KEYSTONE_5001-Footprint-1]  (value not drawn)
TP19  TEST_POINT_BLACK_KEYSTONE_5001  [TEST_POINT_BLACK_KEYSTONE_5001-Footprint-1]  (value not drawn)
TP20  TEST_POINT_BLACK_KEYSTONE_5001  [TEST_POINT_BLACK_KEYSTONE_5001-Footprint-1]  (value not drawn)
TP21  TEST_POINT_BLACK_KEYSTONE_5001  [TEST_POINT_BLACK_KEYSTONE_5001-Footprint-1]  (value not drawn)
TP24  TEST_POINT_BLACK_KEYSTONE_5001  [TEST_POINT_BLACK_KEYSTONE_5001-Footprint-1]  (value not drawn)
U7  OPA317ID  [SOIC127P600X175-8N]
U15  AD7124-8BCPZ  [QFN50P500X500X75_HS-33N]
U16  Manufacturer Part Number: NCP1117DT50RKG  Voltage - Output: 5V  Current - Output: 1A  [DPAK]  (hidden comment: LDO_NCP1117DT50RKG)
U17  ADP7142ARDZ-R7  [SOIC127P600X175_HS-9N]
U18  ADP7142ARDZ-R7  [SOIC127P600X175_HS-9N]

### Sub-sheets
LC1 = LoadCell.SchDoc: REF (in), GND (in), OUT (out), V_BR (in), AVDD (in)
LC2 = LoadCell.SchDoc: REF (in), GND (in), OUT (out), V_BR (in), AVDD (in)
PT1 = PressureTransducer.SchDoc: V_PT (in), AVDD, GND (in), OUT1 (out), OUT2 (out)
PT2 = PressureTransducer.SchDoc: V_PT (in), AVDD, GND (in), OUT1 (out), OUT2 (out)
PT3 = PressureTransducer.SchDoc: V_PT (in), AVDD, GND (in), OUT1 (out), OUT2 (out)
PT4 = PressureTransducer.SchDoc: V_PT (in), AVDD, GND (in), OUT1 (out), OUT2 (out)
TC1 = Thermocouple.SchDoc: GND (in), REF (in), AVDD (in), OUT (out)
TC2 = Thermocouple.SchDoc: GND (in), REF (in), AVDD (in), OUT (out)
TC3 = Thermocouple.SchDoc: GND (in), REF (in), AVDD (in), OUT (out)

### Ports
ADC_SPI (harness SPI+CS), GND (in), IOVDD (in), SYNC (in), VBATT (in)

### Harnesses
SPI+CS: SCK, MOCI, MICO, ~{CS}

### Nets
AGND: C49.1 C50.2 C51.2 C53.2 C54.2 C55.2 C56.2 C57.2 C58.2 C70.2 C71.2 C76.2(K) C78.2 NT1.2 R72.1 R73.1 R74.1 R85.1 R86.1 U7.4(V-) U15.13(REFIN1-) U15.21(AIN15/REFIN2-) U15.23(AVSS) U15.33(PAD/AVSS) U16.1(GND) U17.4(GND) U17.9(PAD) U18.4(GND) U18.9(PAD) ; sheet LC1/GND, sheet PT1/GND, sheet TC1/GND, sheet TC2/GND, sheet TC3/GND, sheet LC2/GND, sheet PT2/GND, sheet PT3/GND, sheet PT4/GND  [also labelled GND]
AVDD: C57.1 C58.1 C76.1(A) C78.1 R83.2 R84.2 TP14.1 U7.7(V+) U15.26(AVDD) U18.1(VOUT) U18.2(VOUT) ; sheet LC1/AVDD, sheet PT1/AVDD, sheet TC1/AVDD, sheet TC2/AVDD, sheet TC3/AVDD, sheet LC2/AVDD, sheet PT2/AVDD, sheet PT3/AVDD, sheet PT4/AVDD
DGND: C48.2 C77.2(K) C79.2 NT1.1 U15.3(DGND) ; port GND
IOVDD: C77.1(A) C79.1 U15.2(IOVDD) ; port IOVDD
VBATT: FB4.1 FB6.1 FB9.1 ; port VBATT  [project net 12V0]
VBR: C51.1 R69.2 R70.2 TP12.1 U17.1(VOUT) U17.2(VOUT) ; sheet LC1/V_BR, sheet LC2/V_BR
VPT: C55.1 FB7.2 R71.2 TP13.1 ; sheet PT1/V_PT, sheet PT2/V_PT, sheet PT3/V_PT, sheet PT4/V_PT  [project net V_PT]
ADC_CS: TP18.1 U15.32(~{CS}) ; port ADC_SPI.~{CS}
ADC_MICO: TP19.1 U15.28(DOUT/~{RDY}) ; port ADC_SPI.MICO
ADC_MOCI: TP20.1 U15.29(DIN) ; port ADC_SPI.MOCI
ADC_SCK: TP21.1 U15.30(SCLK) ; port ADC_SPI.SCK
ADC_SYNC: TP24.1 U15.27(~{SYNC}) ; port SYNC
AIN1: U15.5(AIN1) ; sheet PT1/OUT1
AIN2: U15.6(AIN2) ; sheet PT1/OUT2
AIN3: U15.7(AIN3) ; sheet PT2/OUT1
AIN4: U15.8(AIN4) ; sheet PT2/OUT2
AIN5: U15.9(AIN5) ; sheet PT3/OUT1
AIN6: U15.10(AIN6) ; sheet PT3/OUT2
AIN7: U15.11(AIN7) ; sheet PT4/OUT1
AIN8: U15.14(AIN8) ; sheet PT4/OUT2
AIN9: R58.2 U15.15(AIN9)
AIN10: R61.2 U15.16(AIN10)
AIN11: R64.2 U15.17(AIN11)
AIN12: U15.18(AIN12) ; sheet LC1/OUT
AIN13: U15.19(AIN13) ; sheet LC2/OUT
REF-1V65: TP16.1 U7.2(-) U7.6(OUT) U15.4(AIN0) ; sheet LC1/REF, sheet TC1/REF, sheet TC2/REF, sheet TC3/REF, sheet LC2/REF
VBR-REF: R70.1 R73.2 TP15.1 U15.12(REFIN1+)
VPT-REF: R71.1 R74.2 TP17.1 U15.20(AIN14/REFIN2+)
NetC48_1: C48.1 U15.1(REGCAPD)
NetC49_2: C49.2 U15.24(REGCAPA)
NetC50_1: C50.1 FB4.2 U17.5(EN) U17.7(VIN) U17.8(VIN)
NetC53_1: C53.1 FB6.2 U16.3(VI)
NetC54_1: C54.1 FB7.1 U16.2(VO)
NetC56_1: C56.1 FB9.2 U18.5(EN) U18.7(VIN) U18.8(VIN)
NetC70_1: C70.1 U17.6(SS)
NetC71_1: C71.1 U18.6(SS)
NetR58_1: R58.1 ; sheet TC1/OUT
NetR61_1: R61.1 ; sheet TC2/OUT
NetR64_1: R64.1 ; sheet TC3/OUT
NetR69_1: R69.1 R72.2 U17.3(ADJ)
NetR83_1: R83.1 R85.2 U7.3(+)
NetR84_1: R84.1 R86.2 U18.3(ADJ)

Not connected (* = marked no-connect by the designer): U15 22(REFOUT)* 25(PSW)* 31(CLK)*

### Notes on the sheet
- Bridge excitation voltage is 10V, and each load cell draws 35mA max
- Presure transducer supply voltage. Unclear if PTs have amps or not? Unclear how much power they draw.
  Consider changing to an ADP7142 to simplify BOM
- Mid-Rail reference voltage. The instrumentation amps need this to reference their outputs off of. It needs to be buffered, or the draw from connected devices will skew it.
- IOVDD is 3.3V, powered from top sheet
  AVDD is unipolar, 3.6V from LDO
- (in symbol CMP-00030-1) _
- (in symbol CMP-00032-1) +

### Library data of the parts
C48 C49 C78 = CMP-119-0065-1: CAP CER 0603 0.1µF X7R 50V 10%; Manufacturer: Murata Electronics North America; Capacitance - pF (Machine readable): #NAME?; Rule: UNIONINDEX=0|RULEKIND=PolygonConnect|NETSCOPE=AnyNet|LAYERKIND=SameLayer|NAME=Schematic Polygon Connect Style|CONNECTSTYLE=Direct|RELIEFCONDUCTORWIDTH=10mil|RELIEFENTRIES=4|POLYGONRELIEFANGLE=45 Angle|AIRGAPWIDTH=10mil|UNIT=Imperial; Dielectric: X7R; Rated Voltage: 50V
C50 C51 C56 C57 = CMP-119-0069-1: CAP CER 2.2UF 16V X5R 0603 10%; Manufacturer: Murata Electronics North America; Capacitance - pF (Machine readable): #NAME?; Rated Voltage: 25V; Dielectric: X5R
C53-C55 = CMP-119-0071-1: CAP CER 10UF 35V X5R 0603 20%; Manufacturer: Murata Electronics North America; Capacitance - pF (Machine readable): #NAME?; Dielectric: X5R
C58 = CMP-119-0065-1: CAP CER 0603 0.1µF X7R 50V 10%; Manufacturer: Murata Electronics North America; Capacitance - pF (Machine readable): #NAME?; Dielectric: X7R; Rated Voltage: 50V
C70 C71 = CMP-119-0040-1: CAP CER 0603 1000pF X7R 50V 10%; Manufacturer: Murata Electronics North America; Capacitance - pF (Machine readable): #NAME?; Dielectric: X7R; Rated Voltage: 50V
C76 C77 = CMP-00032-1: Cap Tant Solid 1uF 10V L CASE 10% (1.6 X 0.85 X 0.85mm) SMD 1608-10 7.5 Ohm 125 Plastic T/R; Dissipation Factor: 6%; Dielectric Material: Tantalum; ESR (Equivalent Series Resistance): 7.5R; Leakage Current: 500nA; Polarity: Polar; Rule: PcbType=ProtelPcb; Height - Seated (Max): 0.039inch; Case Code (Imperial): 0603; Package Quantity: 1; Height: 1mm; RoHS Compliant: Yes; Number of Pins: 2; Min Operating Temperature: -55°C; Radiation Hardening: No; Features: General Purpose; Max Operating Temperature: 125°C; Depth: 0.85mm; Length: 1.6mm; Lead Free: Lead Free; Voltage Rating: 10V; Tolerance: 10%; Width: 0.033inch; Case/Package: 0603; Termination: SMD/SMT; Packaging: Tape and Reel; REACH SVHC: No SVHC; Case Code (Metric): 1608; Mount: Surface Mount; Voltage Rating (DC): 10V
C79 = CMP-119-0065-1: CAP CER 0603 0.1µF X7R 50V 10%; Manufacturer: Murata Electronics North America; Capacitance - pF (Machine readable): #NAME?; Rule: PcbType=ProtelPcb; Dielectric: X7R; Rated Voltage: 50V
FB4 FB6 FB7 FB9 = CMP-051-0015-1: FERRITE BEAD 120 OHM @ 100 MHz; Manufacturer: Taiyo Yuden; Manufacturer Part Number: BKP1608HS121-T; Filter Type: Power Line; Number of Lines: 1; Current Rating (Max): 2.7A; DC Resistance (DCR) (Max): 35 mOhm; RoHS: RoHS Compliant; Stock 1: 47959; Pricing 1: 1=0.1, 10=0.059, 25=0.052, 50=0.0474, 100=0.0426, 250=0.0312, 500=0.0227, 1000=0.02223 (USD); Packaging: Cut Tape (CT); Part Status: Active; Ratings: -; Operating Temperature: -55°C ~ 85°C; Package / Case: 0603 (1608 Metric); Mounting Type: Surface Mount; Height (Max): 0.037" (0.95mm); Size / Dimension: 0.063" L x 0.031" W (1.60mm x 0.80mm); ComponentLink1URL: http://ds.yuden.co.jp/TYCOMPAS/ut/detail.do?productNo=BKP1608HS121-T&fileName=BKP1608HS121-T_SS&mode=specSheetDownload; ComponentLink1Description: http://ds.yuden.co.jp/TYCOMPAS/ut/detail.do?productNo=BKP1608HS121-T&fileName=BKP1608HS121-T_SS&mode=specSheetDownload; Impedance @ Frequency: 120 Ohm @ 100MHz; Design Item ID: FB_120@100MHz_0603; Source: inductor.SchLib
NT1 = CMP-057-0001-1: Net tie. Use sparingly.; Source: miscellaneous.SchLib; Design Item ID: NETTIE
R58 R61 R64 = CMP-126-0000-2: RES SMD 0 OHM JUMPER 1/10W 0603; Manufacturer Part Number: RC0603FR-070RL; Manufacturer: Yageo; Power (Watts): 0.1W, 1/10W; Resistance (Sortable): 0; Tolerance: Jumper; Temperature Coefficient: -; Operating Temperature: -55°C ~ 155°C; Image: //media.digikey.com/Renders/Yageo%20Renders/0603-(1608-Metric).jpg; Datasheets: http://www.yageo.com/documents/recent/PYu-RC_Group_51_RoHS_L_9.pdf
R69 = CMP-126-0277-2: RES SMD 11K OHM 1% 1/10W 0603; Manufacturer Part Number: RC0603FR-0711KL; Manufacturer: Yageo; Power (Watts): 0.1W, 1/10W; Resistance (Sortable): 11000; Temperature Coefficient: ±100ppm/°C; Datasheets: http://www.yageo.com/documents/recent/PYu-RC_Group_51_RoHS_L_9.pdf; Image: //media.digikey.com/Renders/Yageo%20Renders/0603-(1608-Metric).jpg; Tolerance: ±1%; Operating Temperature: -55°C ~ 155°C
R70 = CMP-126-0383-2: RES SMD 102K OHM 1% 1/10W 0603; Manufacturer: Yageo; Manufacturer Part Number: RC0603FR-07102KL; Power (Watts): 0.1W, 1/10W; Resistance (Sortable): 102000; Temperature Coefficient: ±100ppm/°C; Operating Temperature: -55°C ~ 155°C; Datasheets: http://www.yageo.com/documents/recent/PYu-RC_Group_51_RoHS_L_9.pdf; Image: //media.digikey.com/Renders/Yageo%20Renders/0603-(1608-Metric).jpg; Tolerance: ±1%
R71 = CMP-126-0273-2: RES SMD 10K OHM 1% 1/10W 0603; Manufacturer: Yageo; Manufacturer Part Number: RC0603FR-0710KL; Power (Watts): 0.1W, 1/10W; Resistance (Sortable): 10000; Temperature Coefficient: ±100ppm/°C; Operating Temperature: -55°C ~ 155°C; Datasheets: http://www.yageo.com/documents/recent/PYu-RC_Group_51_RoHS_L_9.pdf; Image: //media.digikey.com/Renders/Yageo%20Renders/0603-(1608-Metric).jpg; Tolerance: ±1%
R72 = CMP-126-0187-2: RES SMD 1.5K OHM 1% 1/10W 0603; Manufacturer: Yageo; Manufacturer Part Number: RC0603FR-071K5L; Temperature Coefficient: ±100ppm/°C; Resistance (Sortable): 1500; Power (Watts): 0.1W, 1/10W; Image: //media.digikey.com/Renders/Yageo%20Renders/0603-(1608-Metric).jpg; Tolerance: ±1%; Datasheets: http://www.yageo.com/documents/recent/PYu-RC_Group_51_RoHS_L_9.pdf; Operating Temperature: -55°C ~ 155°C
R73 = CMP-126-0331-2: RES SMD 34K OHM 1% 1/10W 0603; Manufacturer: Yageo; Manufacturer Part Number: RC0603FR-0734KL; Resistance (Sortable): 34000; Temperature Coefficient: ±100ppm/°C; Power (Watts): 0.1W, 1/10W; Image: //media.digikey.com/Renders/Yageo%20Renders/0603-(1608-Metric).jpg; Tolerance: ±1%; Operating Temperature: -55°C ~ 155°C; Datasheets: http://www.yageo.com/documents/recent/PYu-RC_Group_51_RoHS_L_9.pdf
R74 = CMP-126-0273-2: RES SMD 10K OHM 1% 1/10W 0603; Manufacturer: Yageo; Manufacturer Part Number: RC0603FR-0710KL; Resistance (Sortable): 10000; Temperature Coefficient: ±100ppm/°C; Power (Watts): 0.1W, 1/10W; Image: //media.digikey.com/Renders/Yageo%20Renders/0603-(1608-Metric).jpg; Tolerance: ±1%; Operating Temperature: -55°C ~ 155°C; Datasheets: http://www.yageo.com/documents/recent/PYu-RC_Group_51_RoHS_L_9.pdf
R83 R85 = CMP-126-0172-2: RES SMD 1K OHM 1% 1/10W 0603; Manufacturer: Yageo; Manufacturer Part Number: RC0603FR-071KL; Power (Watts): 0.1W, 1/10W; Resistance (Sortable): 1000; Temperature Coefficient: ±100ppm/°C; Image: //media.digikey.com/Renders/Yageo%20Renders/0603-(1608-Metric).jpg; Operating Temperature: -55°C ~ 155°C; Tolerance: ±1%; Datasheets: http://www.yageo.com/documents/recent/PYu-RC_Group_51_RoHS_L_9.pdf
R84 = CMP-126-0304-2: RES SMD 20K OHM 1% 1/10W 0603; Manufacturer Part Number: RC0603FR-0720KL; Manufacturer: Yageo; Temperature Coefficient: ±100ppm/°C; Power (Watts): 0.1W, 1/10W; Resistance (Sortable): 20000; Datasheets: http://www.yageo.com/documents/recent/PYu-RC_Group_51_RoHS_L_9.pdf; Tolerance: ±1%; Operating Temperature: -55°C ~ 155°C; Image: //media.digikey.com/Renders/Yageo%20Renders/0603-(1608-Metric).jpg
R86 = CMP-126-0273-2: RES SMD 10K OHM 1% 1/10W 0603; Manufacturer Part Number: RC0603FR-0710KL; Manufacturer: Yageo; Power (Watts): 0.1W, 1/10W; Temperature Coefficient: ±100ppm/°C; Resistance (Sortable): 10000; Tolerance: ±1%; Operating Temperature: -55°C ~ 155°C; Datasheets: http://www.yageo.com/documents/recent/PYu-RC_Group_51_RoHS_L_9.pdf; Image: //media.digikey.com/Renders/Yageo%20Renders/0603-(1608-Metric).jpg
TP12-TP21 TP24 = CMP-055-0004-2: BLACK T/H TEST POINT; Manufacturer Part Number: 5001; Manufacturer: Keystone Electronics; Material - Body: Phosphor Bronze; Material - Insulation: Nylon 46, UL 94V-0; Plating: Silver; ComponentLink1Description: http://www.keyelco.com/product-pdf.cfm?p=1310; Source: mechanical.SchLib; Part Status: Active; Stock 1: 718799; RoHS: RoHS Compliant; Packaging: Bulk; Mounting Type: 0.040" (1.02mm) Hole Diameter; ComponentLink1URL: http://www.keyelco.com/product-pdf.cfm?p=1310; Pricing 1: 1=0.37, 10=0.316, 50=0.2298, 100=0.2209, 250=0.19832, 500=0.18932, 1000=0.1616, 2500=0.14424, 5000=0.13523 (USD); Size / Dimension: 0.100" Dia x 0.180" L (2.54mm x 4.57mm); Color: Black; Design Item ID: TEST_POINT_BLACK_KEYSTONE_5001
U7 = CMP-00030-1: Op Amp Single Precision Amplifier R-R I/O ±2.75V/5.5V 8-Pin SOIC Tube; Number of Channels: 1; Max Supply Voltage: 5.5V; Voltage Gain: 110dB; Input Bias Current: 275pA; Slew Rate: 0.15V/µs; Common Mode Rejection Ratio: 95dB; Operating Supply Current: 21uA; Input Voltage Noise Density: 55nV/sqrt Hz; Min Supply Voltage: 1.8V; Input Offset Voltage (Vos): 20uV; Gain Bandwidth Product: 300kHz; Output Current per Channel: 5mA; Max Dual Supply Voltage: 2.75V; Min Dual Supply Voltage: 900mV; REACH SVHC: No SVHC; Lead Free: Lead Free; Number of Circuits: 1; Case/Package: SOIC; Number of Amplifiers: 1; Nominal Supply Current: 21uA; Packaging: Rail/Tube; Max Operating Temperature: 125°C; Min Operating Temperature: -40°C; Bandwidth: 300kHz; Number of Pins: 8; Package Quantity: 75; RoHS Compliant: Yes; Mount: Surface Mount
U15 = CMP-00001-5: ANALOG DEVICES - AD7124-8BCPZ - ADC, 24BIT, 19.2KSPS, SPI, LFCSP-32; Supply Type: Analog,Digital; Quiescent Current: 2.8mA; Input Offset Voltage (Vos): 1mV; Min Supply Voltage: 2.7V; Input Capacitance: 5.5pF; Settling Time: 1us; Sampling Rate: 19.2KS/s; Dual Supply Voltage: 1.8V; Number of Bits: 24; Slew Rate: 20V/µs; Operating Supply Current: 5.6mA; Max Supply Voltage: 3.6V; Polarity: Bipolar,Unipolar; Resolution: 24b; Power Supply Rejection Ratio (PSRR): 95dB; Common Mode Rejection Ratio: 76dB; Number of A/D Converters: 1; Interface: SPI; Max Operating Temperature: 125°C; Min Operating Temperature: -55°C; REACH SVHC: No SVHC; Mount: Surface Mount; Height: 0.75mm; Number of Pins: 32; Packaging: Tray; Width: 5.1mm; Lead Free: Contains Lead; Length: 5.1mm
U16 = CMP-048-0060-1: IC REG LDO 5V 1A DPAK; Manufacturer: ON Semiconductor; Regulator Topology: Positive Fixed; Voltage - Dropout (Typical): 1.07V @ 800mA; Number of Regulators: 1; Voltage - Input: Up to 20V; RoHS: RoHS Compliant; Stock 1: 1849; Pricing 1: 1=0.46, 10=0.391, 100=0.2919, 500=0.22932, 1000=0.17721 (USD); Packaging: Cut Tape (CT); Part Status: Active; Current - Limit (Min): 1A; Operating Temperature: 0°C ~ 125°C; Mounting Type: Surface Mount; Package / Case: TO-252-3, DPak (2 Leads + Tab), SC-63; Supplier Device Package: DPAK-3; ComponentLink1URL: http://www.onsemi.com/pub_link/Collateral/NCP1117-D.PDF; ComponentLink1Description: http://www.onsemi.com/pub_link/Collateral/NCP1117-D.PDF; Source: ic_pmic.SchLib; Design Item ID: LDO_NCP1117DT50RKG
U17 U18 = CMP-00002-2: IC REG LIN POS ADJ 200MA 8SOIC; Dropout Voltage: 200mV; Output Voltage: 39.8V; Max Output Voltage: 39V; Max Input Voltage: 40V; Min Output Voltage: 1.2V; Polarity: Positive; Number of Outputs: 1; Accuracy: 0.8%; Operating Supply Current: 180uA; Quiescent Current: 50uA; Min Input Voltage: 2.7V; Min Current Limit: 250mA; Output Type: Adjustable; Case/Package: SOIC; Package Quantity: 1000; Number of Pins: 8; Contact Plating: Gold; Packaging: Tape and Reel; REACH SVHC: No SVHC; Min Operating Temperature: -40°C; Output Current: 200mA; Number of Regulators: 1; Max Output Current: 200mA; Mount: Surface Mount; Max Operating Temperature: 125°C; Lead Free: Contains Lead